# EAGLE design logic (EAGLE 9.5.1)
Assembly variants: BASIC
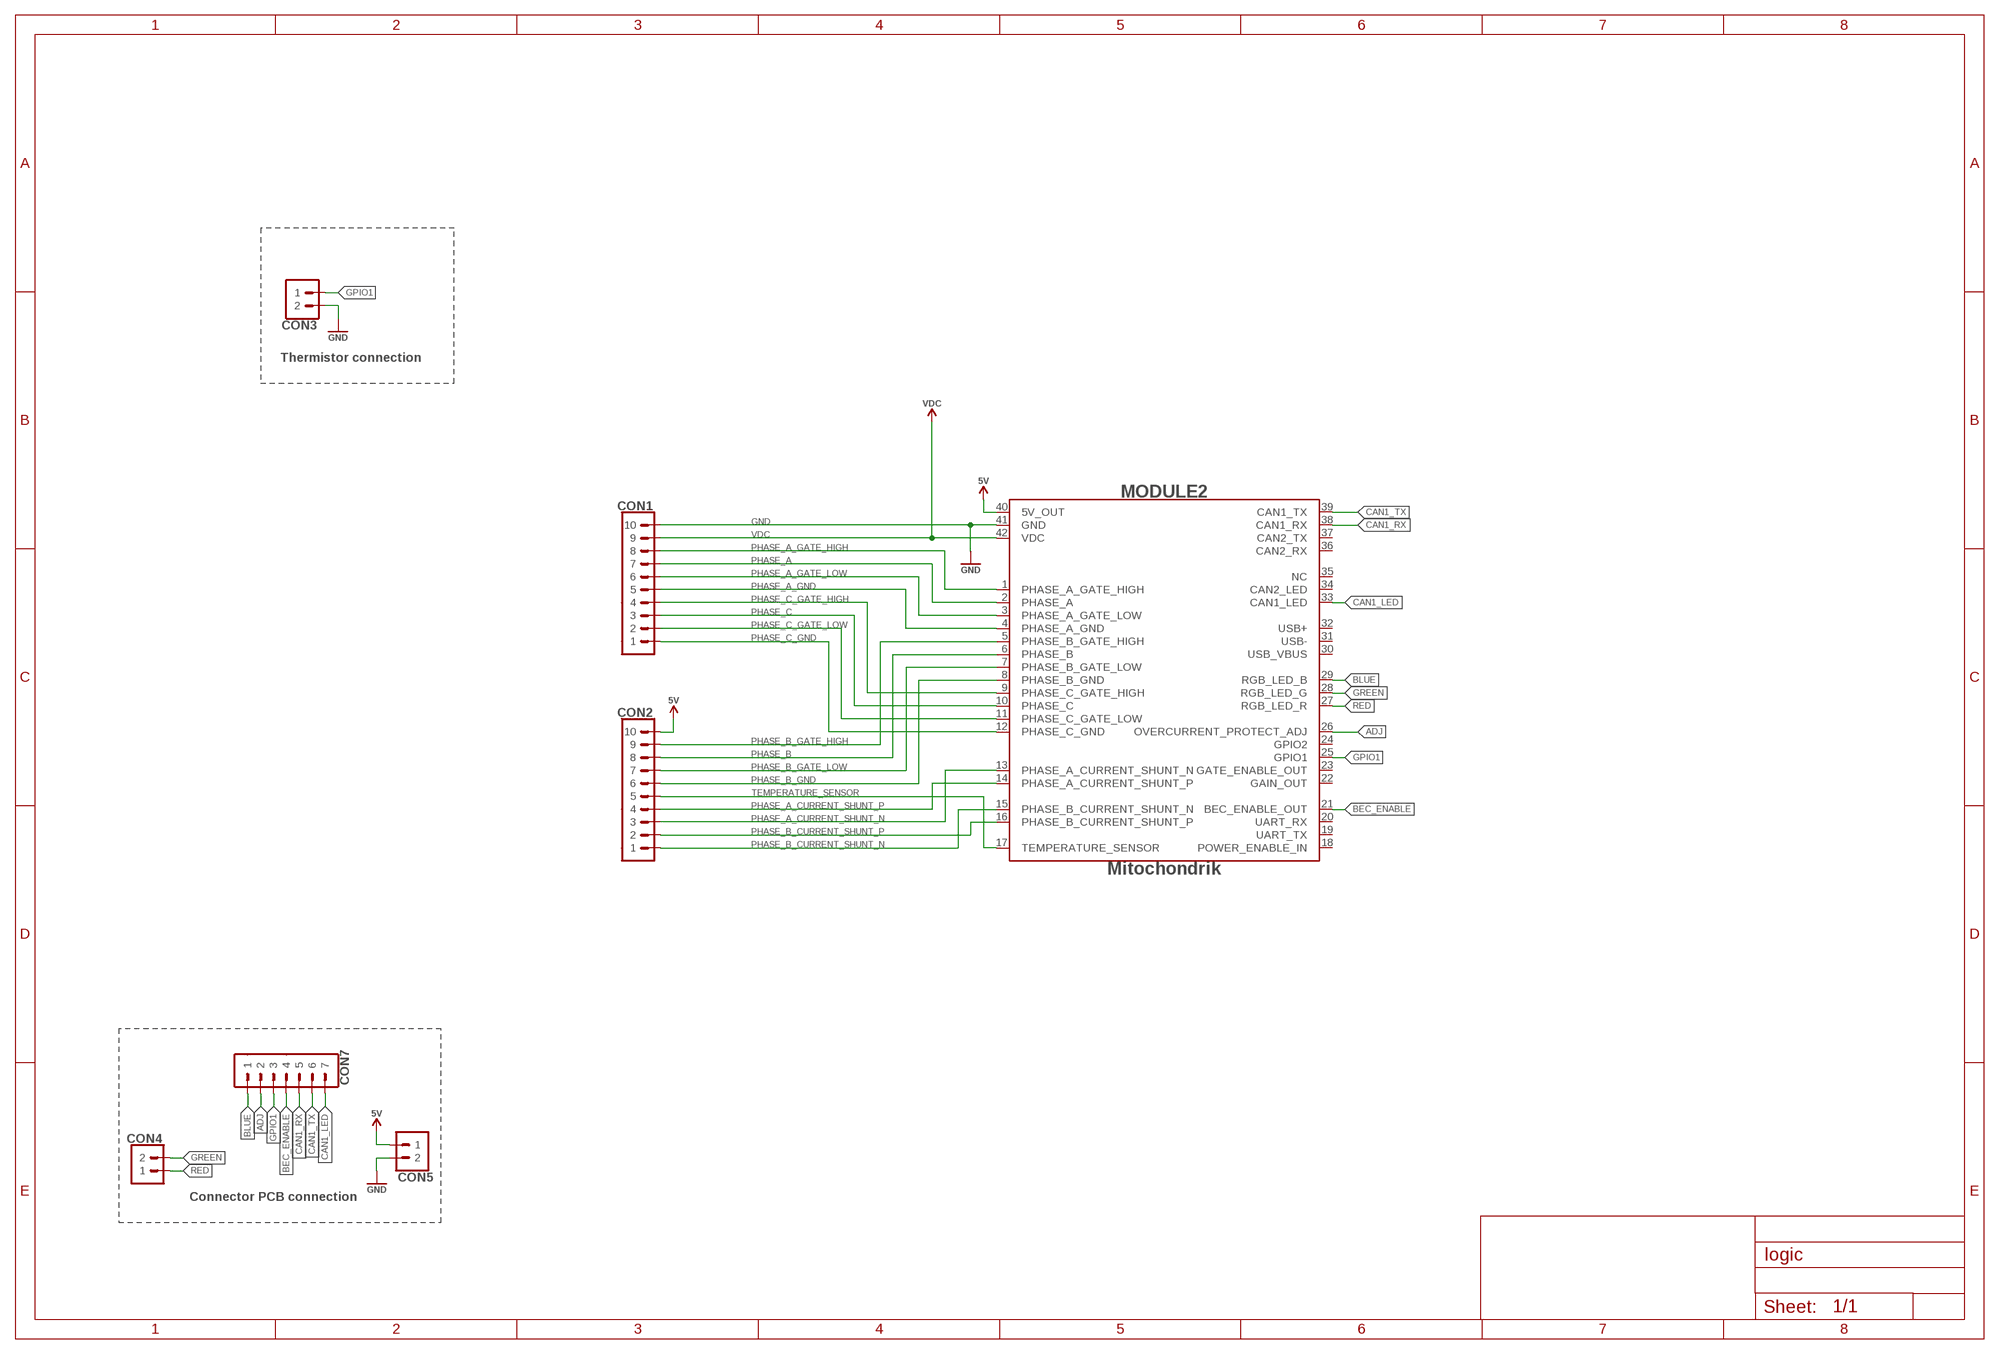
[diagram p0: schematic, sheet 1]

## Parts
CON1  PINHEAD_1X10-2  [1X10-PTH_2]
CON2  PINHEAD_1X10-2  [1X10-PTH_2]
CON3  PINHEAD_1X02-2  [1X02-PTH-2]  (not fitted in variant BASIC)
CON4  PINHEAD_1X02-2  [1X02-PTH-2]
CON5  PINHEAD_1X02-2  [1X02-PTH-2]
CON7  PINHEAD_1X07-2  [1X07-PTH-2]
MODULE2  MITOHONDRIQUE_V0.2-TH  [MITOHONDRIQUE-TH]

## Nets
ADJ: CON7.2 MODULE2.26(OVERCURRENT_PROTECT_ADJ)
BEC_ENABLE: CON7.4 MODULE2.21(BEC_ENABLE_OUT)
BLUE: CON7.1 MODULE2.29(RGB_LED_B)
CAN1_LED: CON7.7 MODULE2.33(CAN1_LED)
CAN1_RX: CON7.5 MODULE2.38(CAN1_RX)
CAN1_TX: CON7.6 MODULE2.39(CAN1_TX)
GND: CON1.10 CON3.2 CON5.2 MODULE2.41(GND)
GPIO1: CON3.1 CON7.3 MODULE2.25(GPIO1)
GREEN: CON4.2 MODULE2.28(RGB_LED_G)
PHASE_A [HV]: CON1.7 MODULE2.2(PHASE_A)
PHASE_A_CURRENT_SHUNT_N: CON2.3 MODULE2.13(PHASE_A_CURRENT_SHUNT_N)
PHASE_A_CURRENT_SHUNT_P: CON2.4 MODULE2.14(PHASE_A_CURRENT_SHUNT_P)
PHASE_A_GATE_HIGH [HV]: CON1.8 MODULE2.1(PHASE_A_GATE_HIGH)
PHASE_A_GATE_LOW: CON1.6 MODULE2.3(PHASE_A_GATE_LOW)
PHASE_A_GND: CON1.5 MODULE2.4(PHASE_A_GND)
PHASE_B [HV]: CON2.8 MODULE2.6(PHASE_B)
PHASE_B_CURRENT_SHUNT_N: CON2.1 MODULE2.15(PHASE_B_CURRENT_SHUNT_N)
PHASE_B_CURRENT_SHUNT_P: CON2.2 MODULE2.16(PHASE_B_CURRENT_SHUNT_P)
PHASE_B_GATE_HIGH [HV]: CON2.9 MODULE2.5(PHASE_B_GATE_HIGH)
PHASE_B_GATE_LOW: CON2.7 MODULE2.7(PHASE_B_GATE_LOW)
PHASE_B_GND: CON2.6 MODULE2.8(PHASE_B_GND)
PHASE_C [HV]: CON1.3 MODULE2.10(PHASE_C)
PHASE_C_GATE_HIGH [HV]: CON1.4 MODULE2.9(PHASE_C_GATE_HIGH)
PHASE_C_GATE_LOW: CON1.2 MODULE2.11(PHASE_C_GATE_LOW)
PHASE_C_GND: CON1.1 MODULE2.12(PHASE_C_GND)
RED: CON4.1 MODULE2.27(RGB_LED_R)
TEMPERATURE_SENSOR: CON2.5 MODULE2.17(TEMPERATURE_SENSOR)
VDC [HV]: CON1.9 MODULE2.42(VDC)
VDD_5V: CON2.10 CON5.1 MODULE2.40(5V_OUT) ; supply symbol labelled 5V
Unconnected: MODULE2.18(POWER_ENABLE_IN) MODULE2.19(UART_TX) MODULE2.20(UART_RX) MODULE2.22(GAIN_OUT) MODULE2.23(GATE_ENABLE_OUT) MODULE2.24(GPIO2) MODULE2.30(USB_VBUS) MODULE2.31(USB-) MODULE2.32(USB+) MODULE2.34(CAN2_LED) MODULE2.35(NC) MODULE2.36(CAN2_RX) MODULE2.37(CAN2_TX)

## Notes on the sheet
- Thermistor connection
- Connector PCB connection

## Library data of the parts
CON1 CON2 = pinhead:PINHEAD_1X10
CON3-CON5 = pinhead:PINHEAD_1X02: pinheader 2P
CON7 = pinhead:PINHEAD_1X07: pinheader 7P
MODULE2 = zubax_modules:MITOHONDRIQUE_V0.2; MANF: Zubax Robotics; MANF#: Mitochondrik

## Net classes
1 HV: clearance 0.25 mm to class 0, clearance 0.25 mm

## Board
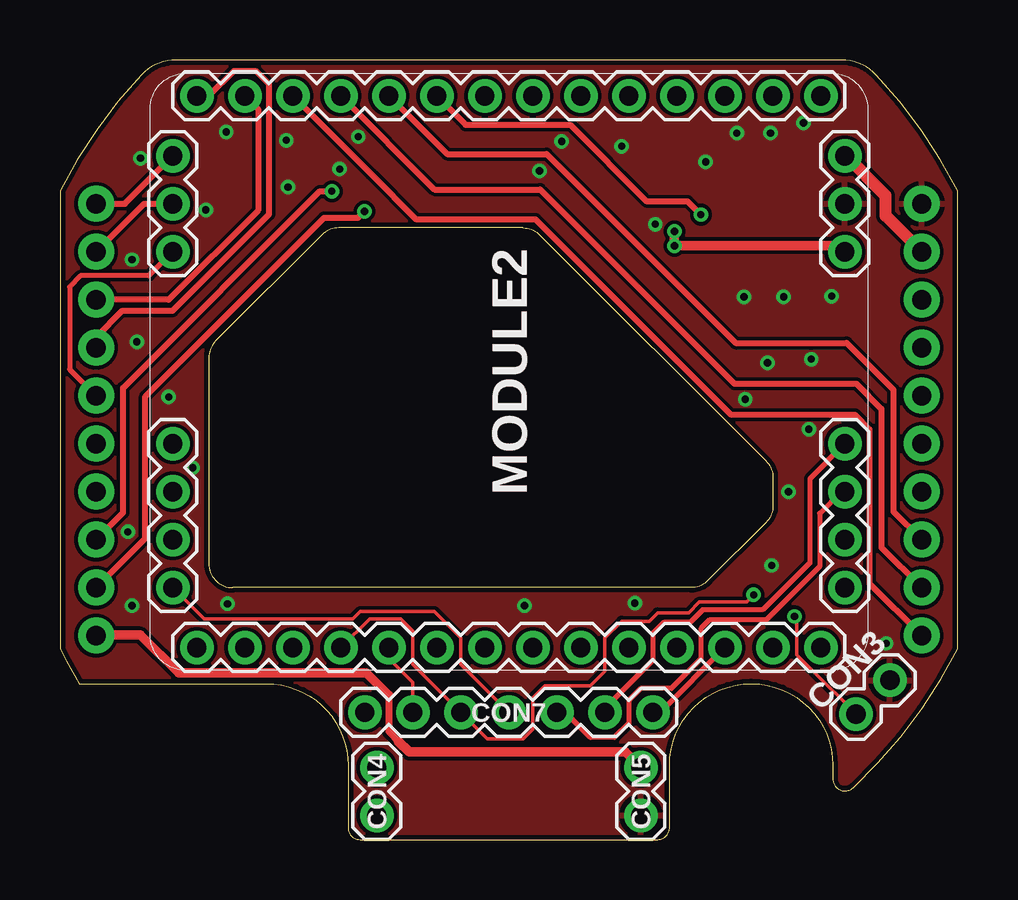
[diagram p1: board, top side]
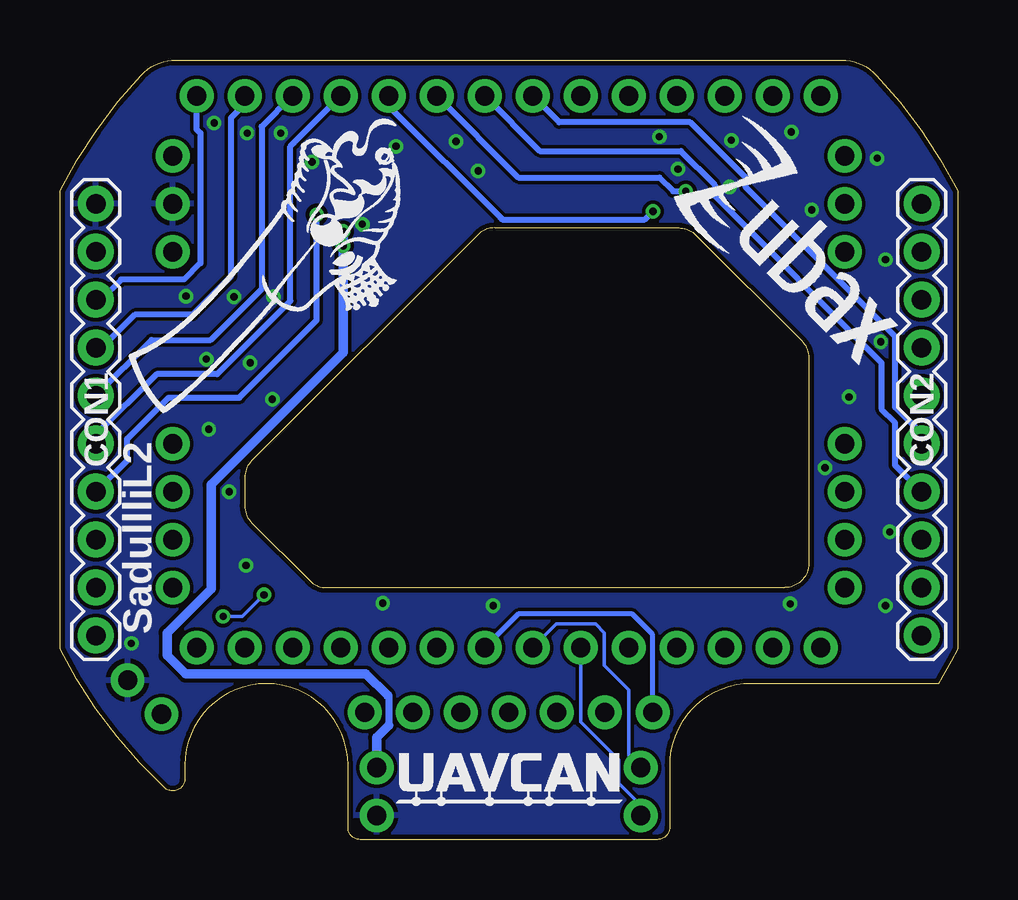
[diagram p2: board, bottom side, seen from below]

Size 37.4 x 32.5 mm. Coordinates in mm from the lower left corner, seen from the top.
Outline: 12,3.1 12,0.5 arc90 12.5,0 24.9,0 arc90 25.4,0.5 25.4,3.1 arc-180 32.2,3.1 32.2,2.53 arc133 33.04,2.16 arc20 37.4,7.94 37.4,27.06 arc16 34.02,31.87 arc47 32.56,32.5 4.84,32.5 arc47 3.39,31.87 arc16 0,27.06 0,7.94 arc5 0.81,6.5 8.6,6.5 arc-90 12,3.1
Outline: 29.41,13.21 27,10.79 arc-45 26.29,10.5 7.2,10.5 arc-90 6.2,11.5 6.2,20.09 arc-45 6.5,20.79 10.91,25.21 arc-45 11.62,25.5 19.29,25.5 arc-45 20,25.21 29.41,15.79 arc-45 29.7,15.09 29.7,13.91 arc-45 29.41,13.21
Copper layers (1*16): Top 0.035mm / dielectric 1mm / Bottom 0.035mm
Design rules "myxa *": minimum track width 0.15mm, minimum drill 0.2mm, track to track 0.15mm, track to pad 0.15mm, pad to pad 0.15mm, via to via 0.15mm, smd to smd 0.15mm, copper to edge 0.2mm, drill to drill 0.2mm, minimum pad ring 0.125mm, minimum via ring 0.125mm, stop-mask expansion 1mil, vias tented up to drill 0.31mm, thermal gap 8mil

### Footprints (pad centres in the part's own frame; a part is rotated, then mirrored left to right if it is on the bottom)
1X10-PTH_2 = drill 0.8 pad 1.5: 1 -9,0; 2 -7,0; 3 -5,0; 4 -3,0; 5 -1,0; 6 1,0; 7 3,0; 8 5,0; 9 7,0; 10 9,0
1X02-PTH-2 = drill 0.8 pad 1.4: 1 -1,0; 2 1,0
1X07-PTH-2 = drill 0.8 pad 1.4: 1 -6,0; 2 -4,0; 3 -2,0; 4 0,0; 5 2,0; 6 4,0; 7 6,0
MITOHONDRIQUE-TH = drill 0.8 pad 1.4: 1 -11.5,13; 2 -11.5,11; 3 -11.5,9; 4 -11.5,7; 5 -11.5,5; 6 -11.5,3; 7 -11.5,1; 8 -11.5,-1; 9 -11.5,-3; 10 -11.5,-5; 11 -11.5,-7; 12 -11.5,-9; 13 -11.5,-11; 14 -11.5,-13; 15 -9,-14; 16 -7,-14; 17 -5,-14; 18 3,-14; 19 5,-14; 20 7,-14; 21 9,-14; 22 11.5,-13; 23 11.5,-11; 24 11.5,-9; 25 11.5,-7; 26 11.5,-5; 27 11.5,-3; 28 11.5,-1; 29 11.5,1; 30 11.5,3; 31 11.5,5; 32 11.5,7; 33 11.5,9; 34 11.5,11; 35 11.5,13; 36 9,14; 37 7,14; 38 5,14; 39 3,14; 40 -5,14; 41 -7,14; 42 -9,14

### Placement (x,y rotation side)
CON1  35.9,17.5 90 bottom
CON2  1.5,17.5 270 bottom
CON3  33.87,5.94 45 top
CON4  13.2,2 90 top
CON5  24.2,2 270 top
CON7  18.7,5.3 0 top
MODULE2  18.7,19.5 270 top
U$1  [ZUBAX_LOGO_5X10]  12.51,26.74 315 bottom
U$3  [UAVCAN_9X2.5]  23.4,1.4 0 bottom
U$5  [DRAGON-15X6]  24.98,31.39 225 bottom

### Tracks (layer width: path | path; a pad name or v marks a point on that pad's centre or on a via)
ADJ
  Top 0.15: CON7.2 14.7,6.55 13.7,7.55 MODULE2.26
BEC_ENABLE
  Top 0.15: CON7.4 16.7,7.3 16.7,8.4 15.6,9.5 12.5,9.5 12.2,9.2 6,9.2 MODULE2.21
BLUE
  Bottom 0.2: CON7.1 12.7,8.55 13.55,9.4 18.3,9.4 MODULE2.29
CAN1_LED
  Top 0.2: CON7.7 25,5.3 MODULE2.33
CAN1_RX
  Top 0.2: MODULE2.38 32.55,14.5 31.65,13.6 31.65,11.38 29.43,9.15 27.05,9.15 26.7,8.8 26.7,7.53 25.48,6.3 24.2,6.3 23.7,5.8 23.7,4.85 23.1,4.25 22.1,4.25 21.05,5.3 CON7.5
CAN1_TX
  Top 0.2: MODULE2.39 31.25,15.05 31.25,11.55 29.28,9.58 26.78,9.58 26.25,9.05 25.15,9.05 24.7,8.6 24.7,7.47 22.7,5.47 CON7.6
GND  (via drill 0.3 pad 0.6)
  other vias: 20.9,29.1 4.53,18.45 6.98,9.83 28.5,22.63 30.15,22.63 32.15,22.65 29.6,29.45 28.2,29.45 30.98,29.88 3,24.18 3.35,28.4 6.93,29.5 5.53,15.5 3,9.75 34.43,8.18 6.08,26.25 9.43,29.15 3.2,20.75 11.65,27.95 12.43,29.3 29.65,11.43 31.2,17.1 23.95,9.85 19.35,9.75 23.4,28.9 26.9,28.25 24.8,25.65 19.98,27.88 28.55,18.35 29.48,19.88 31.3,20.03 30.35,14.5 2.83,12.83 9.5,27.2
  pour Bottom: 39.7,38.5 -2.3,38.5 -2.3,0.01 39.7,0.01
  pour Top: -2.3,38.5 39.7,38.5 39.7,0 -2.3,0
GPIO1  (via drill 0.3 pad 0.6)
  Top 0.15: CON7.3 14.7,7.3 14.7,8.7 14.2,9.2 12.9,9.2 MODULE2.25
  Top 0.152: CON7.3 17.8,4.2 19.3,4.2 19.7,4.6 19.7,5.9 20.2,6.4 22.1,6.4 22.7,7 22.7,8.4 23.4,9.1 24.55,9.1 24.9,9.45 26.19,9.45 26.64,9.9 28.6,9.9 v28.9,10.2 | v30.6,9.3 30.7,9.2 30.7,7.69 31.32,7.07 CON3.1
  Bottom 0.152: v28.9,10.2 29.8,9.3 v30.6,9.3
GREEN
  Bottom 0.15: MODULE2.28 16.72,8.98 15.09,8.98 14.73,8.62 14.73,7.26 13.7,6.24 13.7,3.5 CON4.2
PHASE_A
  Bottom 0.25: MODULE2.2 29.7,30.65 30.28,30.08 30.28,23.48 31.88,21.88 34.28,21.88 35.65,20.5 CON1.7
PHASE_A_CURRENT_SHUNT_N
  Top 0.25: MODULE2.13 8.25,30.45 8.25,26.23 4.53,22.5 CON2.3
PHASE_A_CURRENT_SHUNT_P
  Top 0.25: MODULE2.14 6.2,31 7.25,32.05 8.15,32.05 8.7,31.5 8.7,26.06 4.69,22.05 2.6,22.05 1.5,20.95 CON2.4
PHASE_A_GATE_HIGH
  Bottom 0.25: CON1.8 35.7,22.5 34.85,23.35 32.23,23.35 31.55,24.03 31.55,29.45 31.7,29.6 MODULE2.1
PHASE_A_GATE_LOW
  Bottom 0.25: CON1.6 33.58,20.83 31.13,20.83 29,22.95 29,29.73 27.73,31 MODULE2.3
PHASE_A_GND
  Bottom 0.25: MODULE2.4 27.65,29.05 27.8,28.9 27.8,22.45 30.85,19.4 33.38,19.4 35.9,16.88 CON1.5
PHASE_B  (via drill 0.3 pad 0.6)
  Top 0.25: CON2.8 2.63,13.63 2.63,18.83 10.83,27.03 v11.33,27.03
  Bottom 0.25: MODULE2.6 18.3,27.6 12.43,27.6 11.85,27.03 v11.33,27.03
PHASE_B_CURRENT_SHUNT_N
  Top 0.25: CON2.1 2.7,26.5 MODULE2.15
PHASE_B_CURRENT_SHUNT_P
  Top 0.25: CON2.2 3.5,26.5 MODULE2.16
PHASE_B_GATE_HIGH  (via drill 0.3 pad 0.6)
  Top 0.25: CON2.9 3.55,12.55 3.55,18.48 10.99,25.91 12.41,25.91 v12.69,26.19
  Bottom 0.25: MODULE2.5 23.7,30.55 23.68,30.55 19.07,25.94 18.98,25.85 13.03,25.85 v12.69,26.19
PHASE_B_GATE_LOW
  Bottom 0.25: MODULE2.7 17.4,28.7 11.53,28.7 10.13,27.3 10.13,26.84 3.18,19.89 3.18,17.95 2.6,17.38 2.6,15.6 CON2.7
PHASE_B_GND
  Bottom 0.25: MODULE2.8 16.6,29.9 11.14,29.9 8.83,27.59 8.83,27.2 2.6,20.98 2.6,18.03 1.5,16.93 CON2.6
PHASE_C
  Top 0.25: CON1.3 34.73,13.68 34.73,18.75 32.78,20.7 28.15,20.7 20.28,28.58 16.13,28.58 MODULE2.10
PHASE_C_GATE_HIGH  (via drill 0.3 pad 0.6)
  Top 0.25: MODULE2.9 16.7,30 16.9,29.8 21.25,29.8 24.45,26.6 26.15,26.6 v26.7,26.05
  Bottom 0.25: CON1.4 34.6,15.8 34.6,16.7 32.88,18.43 29.93,18.43 26.7,21.65 v26.7,26.05
PHASE_C_GATE_LOW
  Top 0.25: CON1.2 34.23,12.18 34.23,17.95 33.18,19 28.1,19 20,27.1 15.6,27.1 MODULE2.11
PHASE_C_GND
  Top 0.25: MODULE2.12 12.95,27.75 14.85,25.85 19.82,25.85 27.97,17.7 33.13,17.7 33.73,17.1 33.73,10.68 CON1.1
RED
  Bottom 0.15: CON4.1 13.2,1.42 14.13,2.35 14.13,3.33 15.7,4.9 MODULE2.27
TEMPERATURE_SENSOR
  Top 0.2: MODULE2.17 3.7,23.5 0.85,23.5 0.4,23.05 0.4,19.6 CON2.5
VDC
  Top 0.5: CON1.9 34.4,26 34.4,26.85 32.75,28.5 MODULE2.42
VDD_5V  (via drill 0.3 pad 0.6)
  Top 0.3: 13.7,6 13.7,4.5 14.1,4.1
  Top 0.4: MODULE2.40 32.45,24.75 v25.6,24.75 v25.6,25.35 | CON2.10 1.23,8.53 3.35,8.53 4.94,6.94 12.76,6.94 13.7,6 | CON5.1 23.55,3.65 14.55,3.65 14.1,4.1
  Bottom 0.3: 23.75,6 23.7,5.95 23.7,4.75
  Bottom 0.4: 23.75,6 24.66,6.91 32.17,6.91 32.94,7.67 32.94,8.62 31.1,10.45 31.1,14.8 25.6,20.3 v25.6,24.75 v25.6,25.35 | 23.7,4.75 24.2,4.25 CON5.1

### Text on the board
bPlace: SadullliL2
Reference: PHASE_A_SHUNT_P | PHASE_A_SHUNT_N | PHASE_C_GND | PHASE_C_GATE_LOW | PHASE_C | PHASE_C_GATE_HIGH | PHASE_B_GND | PHASE_B_GATE_LOW | PHASE_B | PHASE_B_GATE_HIGH | PHASE_A_GND | PHASE_A_GATE_LOW | PHASE_A | PHASE_A_GATE_HIGH | PHASE_B_SHUNT_N | VDC | PHASE_B_SHUNT_P | GND | TEMPERATURE | 5V